# Altium schematic sheet EsquematicoAudio.SchDoc
size A4
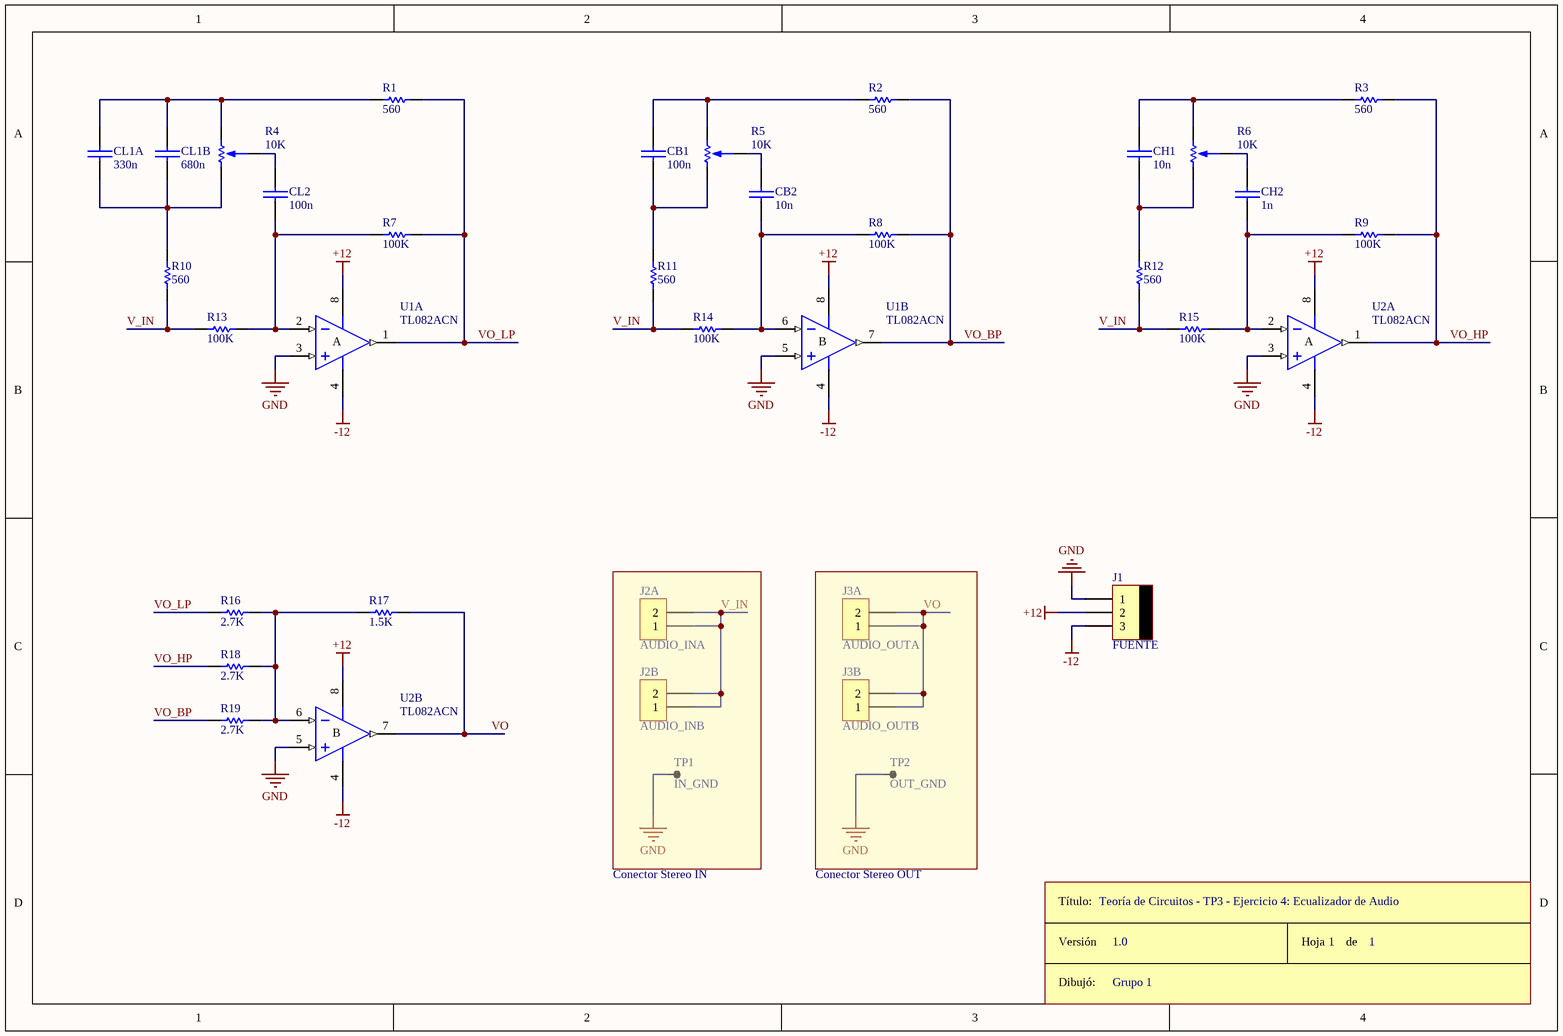
[diagram p0: EsquematicoAudio.SchDoc]

## Parts
1  Rótulo  (value not drawn)
CB1  100n  [CAP100]
CB2  10n  [CAP200]
CH1  10n  [CAP200]
CH2  1n  [CAP100]
CL1A  330n  [CAP100]
CL1B  680n  [CAP100]
CL2  100n  [CAP100]
J1  FUENTE  [MOLEX3]
J2A  AUDIO_INA  [SIP2]
J2B  AUDIO_INB  [SIP2]
J3A  AUDIO_OUTA  [SIP2]
J3B  AUDIO_OUTB  [SIP2]
R1  560  [RES300]
R2  560  [RES300]
R3  560  [RES300]
R4  10K  [POTENCIOMETRO]
R5  10K  [POTENCIOMETRO]
R6  10K  [POTENCIOMETRO]
R7  100K  [RES300]
R8  100K  [RES300]
R9  100K  [RES300]
R10  560  [RES300]
R11  560  [RES300]
R12  560  [RES300]
R13  100K  [RES300]
R14  100K  [RES300]
R15  100K  [RES300]
R16  2.7K  [RES300]
R17  1.5K  [RES300]
R18  2.7K  [RES300]
R19  2.7K  [RES300]
TP1  IN_GND  [TPTH]
TP2  OUT_GND  [TPTH]
U1  TL082ACN  [DIP8]  (parts A,B of 2)
U2  TL082ACN  [DIP8]  (parts A,B of 2)

## Nets
+12: J1.2 U1.8(V+) U2.8(V+)
-12: J1.3 U1.4(V-) U2.4(V-)
GND: J1.1 TP1.1 TP2.1 U1.3(IN+) U1.5(IN+) U2.3(IN+) U2.5(IN+)
V_IN: J2A.1 J2A.2 J2B.1 J2B.2 R10.1 R11.1 R12.1 R13.1 R14.1 R15.1
VO: J3A.1 J3A.2 J3B.1 J3B.2 R17.2 U2.7(OUT)
VO_BP: R2.2 R8.2 R19.1 U1.7(OUT)
VO_HP: R3.2 R9.2 R18.1 U2.1(OUT)
VO_LP: R1.2 R7.2 R16.1 U1.1(OUT)
NetCB1_1: CB1.1 R2.1 R5.1
NetCB1_2: CB1.2 R5.3 R11.2
NetCB2_1: CB2.1 R5.2
NetCB2_2: CB2.2 R8.1 R14.2 U1.6(IN-)
NetCH1_1: CH1.1 R3.1 R6.1
NetCH1_2: CH1.2 R6.3 R12.2
NetCH2_1: CH2.1 R6.2
NetCH2_2: CH2.2 R9.1 R15.2 U2.2(IN-)
NetCL1A_1: CL1A.1 CL1B.2 R1.1 R4.1
NetCL1A_2: CL1A.2 CL1B.1 R4.3 R10.2
NetCL2_1: CL2.1 R4.2
NetCL2_2: CL2.2 R7.1 R13.2 U1.2(IN-)
NetR16_2: R16.2 R17.1 R18.2 R19.2 U2.6(IN-)

## Notes on the sheet
- Conector Stereo IN
- Conector Stereo OUT
- Teoría de Circuitos - TP3 - Ejercicio 4: Ecualizador de Audio
- 1.0
- Grupo 1
- 1
- (in symbol Rótulo) Título:; Versión; Hoja       de; Dibujó:
- (in symbol TL082ACN, part A) A
- (in symbol TL082ACN, part B) B

## Library data of the parts
CB1 CB2 CH1 CH2 CL1A CL1B CL2 = CAP
J1 = MOLEX3
J2A J2B J3A J3B = CON2
R1-R3 R7-R19 = RES
R4-R6 = POTENCIOMETRO
TP1 TP2 = TP
U1 U2 = TL082ACN: General-Purpose J-FET Dual Operational Amplifier; Published: 24-Aug-2001; LatestRevisionDate: 06-Jun-2005; LatestRevisionNote: Stylized 3D Model Added.; DatasheetVersion: Jan-1999; PackageReference: DIP8; Publisher: Altium Limited; PackageDescription: DIP; 8 Leads; Row Spacing 7.62 mm; Pitch 2.54 mm; Code_JEDEC: MO-001-AN; ComponentLink1Description: Manufacturer Link; ComponentLink1URL: http://www.st.com/; ComponentLink2Description: Datasheet; ComponentLink2URL: http://www.st.com/stonline/products/literature/ds/2300/tl082.pdf